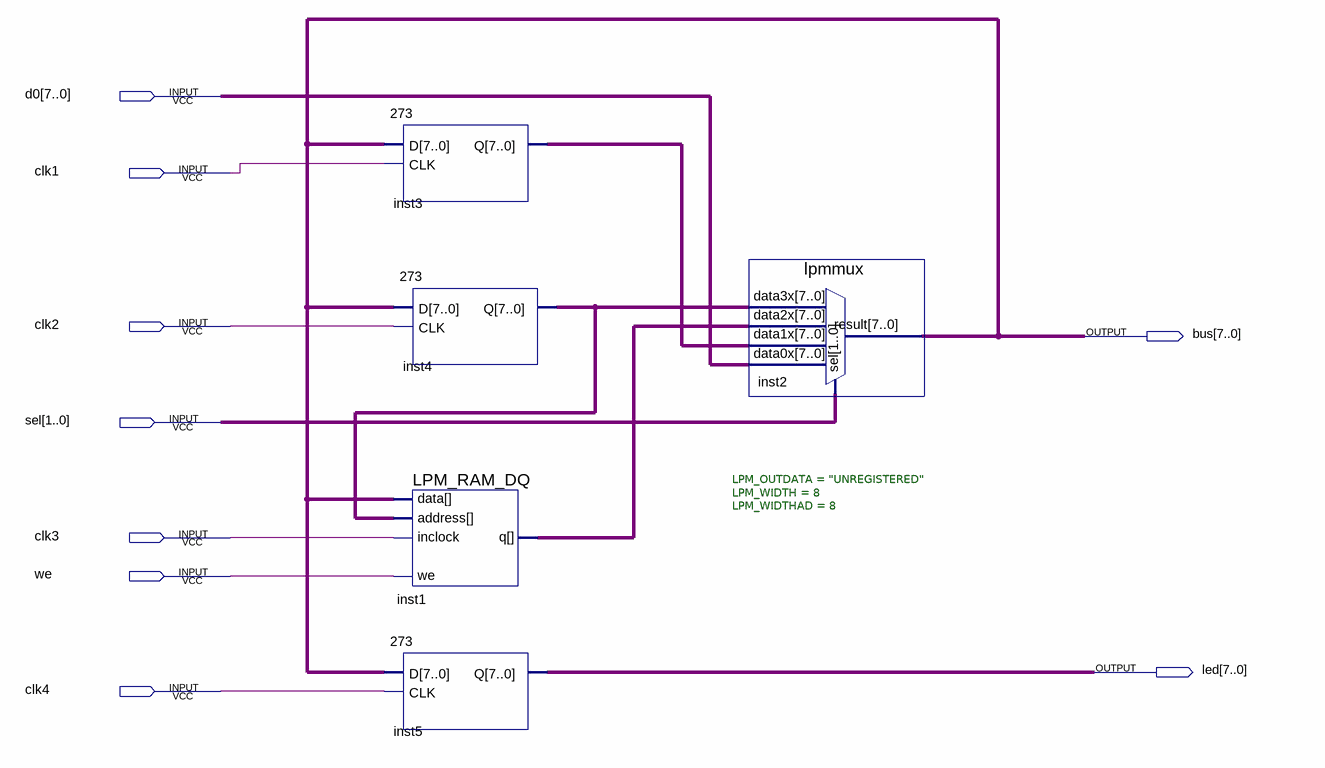
[diagram p0: schematic sheet]
// Quartus schematic BUS.bdf as structural Verilog: 5 symbols, 9 pins
module BUS (
  input  [7:0] d0,
  input  clk1,
  input  clk2,
  input  [1:0] sel,
  input  clk3,
  input  we,
  input  clk4,
  output [7:0] bus,
  output [7:0] led
);

  wire [7:0] inst1_q, inst3_q, inst4_q;

  \273  inst3 (.D(bus), .CLK(clk1), .Q(inst3_q));
  \273  inst4 (.D(bus), .CLK(clk2), .Q(inst4_q));
  LPM_RAM_DQ #(.LPM_OUTDATA("UNREGISTERED"), .LPM_WIDTH(8), .LPM_WIDTHAD(8)) inst1 (
    .address(inst4_q), .data(bus), .inclock(clk3), .we(we), .q(inst1_q));
  \273  inst5 (.D(bus), .CLK(clk4), .Q(led));
  lpmmux inst2 (.data3x(inst4_q), .data2x(inst1_q), .data1x(inst3_q), .data0x(d0), .sel(sel), .result(bus));
endmodule
